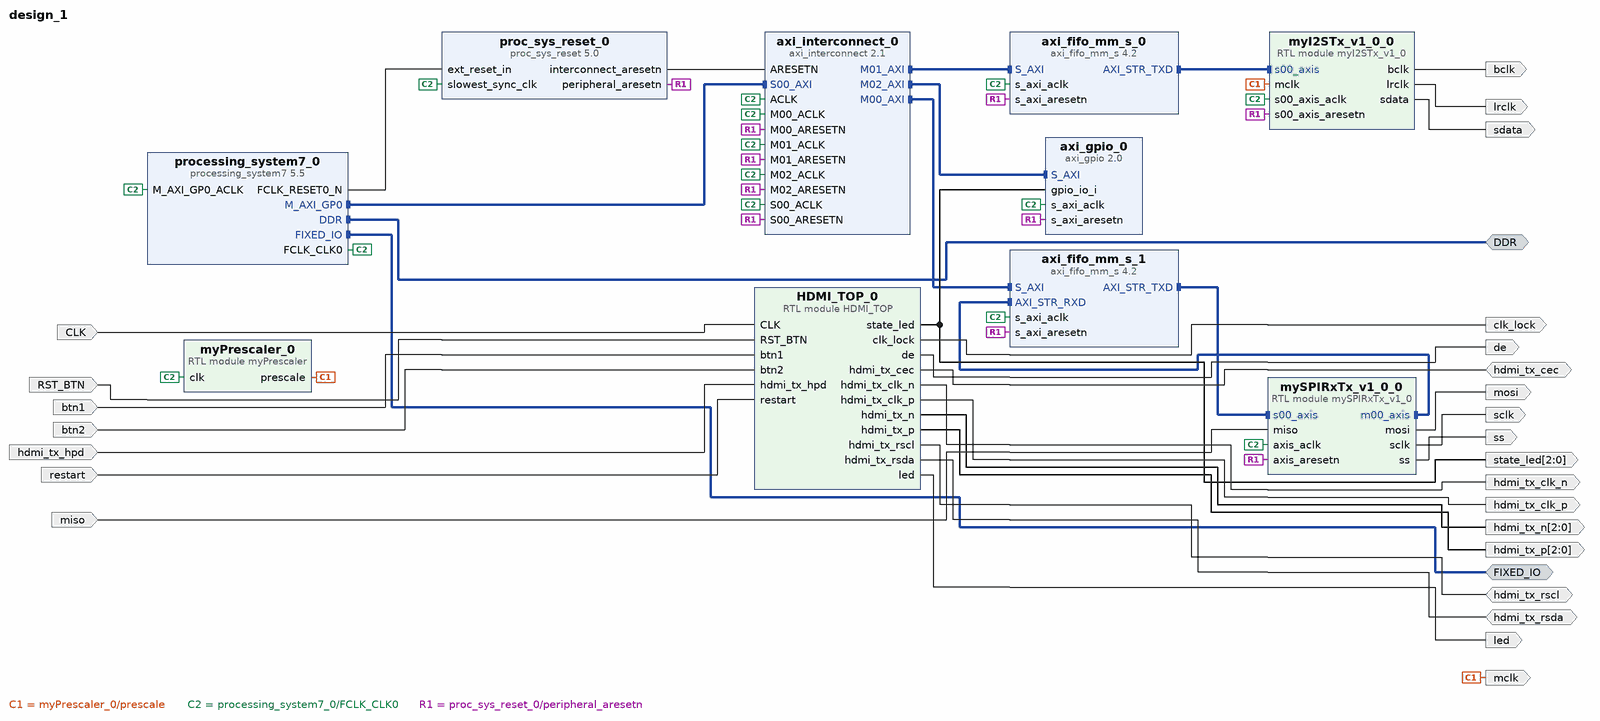
[diagram p0: block diagram of the top level]
# Vivado block design design_1, xc7z020clg400-1, Vivado 2020.2.2
create_bd_design design_1

create_bd_intf_port -mode Master -vlnv xilinx.com:interface:ddrx_rtl:1.0 DDR
create_bd_intf_port -mode Master -vlnv xilinx.com:display_processing_system7:fixedio_rtl:1.0 FIXED_IO
create_bd_port -dir I miso
create_bd_port -dir O mclk
create_bd_port -dir O bclk
create_bd_port -dir O lrclk
create_bd_port -dir O sdata
create_bd_port -dir O sclk
create_bd_port -dir O mosi
create_bd_port -dir O ss
create_bd_port -dir I -type clk CLK
create_bd_port -dir I RST_BTN
create_bd_port -dir I btn1
create_bd_port -dir I btn2
create_bd_port -dir O clk_lock
create_bd_port -dir O de
create_bd_port -dir IO hdmi_tx_cec
create_bd_port -dir O -type clk hdmi_tx_clk_n
create_bd_port -dir O -type clk hdmi_tx_clk_p
create_bd_port -dir I hdmi_tx_hpd
create_bd_port -dir O -from 2 -to 0 hdmi_tx_n
create_bd_port -dir O -from 2 -to 0 hdmi_tx_p
create_bd_port -dir IO hdmi_tx_rscl
create_bd_port -dir IO hdmi_tx_rsda
create_bd_port -dir O led
create_bd_port -dir I restart
create_bd_port -dir O -from 2 -to 0 state_led

create_bd_cell -type ip -vlnv xilinx.com:ip:processing_system7:5.5 processing_system7_0
set_property -dict [list \
  CONFIG.PCW_APU_PERIPHERAL_FREQMHZ 650 \
  CONFIG.PCW_CRYSTAL_PERIPHERAL_FREQMHZ 50 \
  CONFIG.PCW_ENET0_ENET0_IO {MIO 16 .. 27} \
  CONFIG.PCW_ENET0_GRP_MDIO_ENABLE 1 \
  CONFIG.PCW_ENET0_GRP_MDIO_IO {MIO 52 .. 53} \
  CONFIG.PCW_ENET0_PERIPHERAL_ENABLE 1 \
  CONFIG.PCW_ENET0_RESET_ENABLE 1 \
  CONFIG.PCW_ENET0_RESET_IO {MIO 9} \
  CONFIG.PCW_ENET_RESET_ENABLE 1 \
  CONFIG.PCW_ENET_RESET_SELECT {Share reset pin} \
  CONFIG.PCW_FPGA0_PERIPHERAL_FREQMHZ 100 \
  CONFIG.PCW_FPGA1_PERIPHERAL_FREQMHZ 50 \
  CONFIG.PCW_GPIO_MIO_GPIO_ENABLE 1 \
  CONFIG.PCW_GPIO_MIO_GPIO_IO MIO \
  CONFIG.PCW_I2C_RESET_ENABLE 1 \
  CONFIG.PCW_M_AXI_GP0_FREQMHZ 10 \
  CONFIG.PCW_PERIPHERAL_BOARD_PRESET None \
  CONFIG.PCW_PRESET_BANK1_VOLTAGE {LVCMOS 1.8V} \
  CONFIG.PCW_QSPI_GRP_FBCLK_ENABLE 1 \
  CONFIG.PCW_QSPI_GRP_FBCLK_IO {MIO 8} \
  CONFIG.PCW_QSPI_GRP_SINGLE_SS_ENABLE 1 \
  CONFIG.PCW_QSPI_GRP_SINGLE_SS_IO {MIO 1 .. 6} \
  CONFIG.PCW_QSPI_PERIPHERAL_ENABLE 1 \
  CONFIG.PCW_QSPI_QSPI_IO {MIO 1 .. 6} \
  CONFIG.PCW_SD0_GRP_CD_ENABLE 1 \
  CONFIG.PCW_SD0_GRP_CD_IO {MIO 47} \
  CONFIG.PCW_SD0_GRP_WP_ENABLE 0 \
  CONFIG.PCW_SD0_PERIPHERAL_ENABLE 1 \
  CONFIG.PCW_SD0_SD0_IO {MIO 40 .. 45} \
  CONFIG.PCW_SDIO_PERIPHERAL_FREQMHZ 50 \
  CONFIG.PCW_SINGLE_QSPI_DATA_MODE x4 \
  CONFIG.PCW_UART0_PERIPHERAL_ENABLE 1 \
  CONFIG.PCW_UART0_UART0_IO {MIO 14 .. 15} \
  CONFIG.PCW_UART1_PERIPHERAL_ENABLE 0 \
  CONFIG.PCW_UART_PERIPHERAL_FREQMHZ 100 \
  CONFIG.PCW_UIPARAM_DDR_BUS_WIDTH {16 Bit} \
  CONFIG.PCW_UIPARAM_DDR_FREQ_MHZ 525 \
  CONFIG.PCW_UIPARAM_DDR_PARTNO {MT41J256M16 RE-125} \
  CONFIG.PCW_USB0_PERIPHERAL_ENABLE 1 \
  CONFIG.PCW_USB0_RESET_ENABLE 1 \
  CONFIG.PCW_USB0_RESET_IO {MIO 46} \
  CONFIG.PCW_USB0_USB0_IO {MIO 28 .. 39} \
  CONFIG.PCW_USB_RESET_ENABLE 1 \
  CONFIG.PCW_USB_RESET_SELECT {Share reset pin} \
] [get_bd_cells processing_system7_0]
# 481 more settings of processing_system7_0 are not shown: defaults, MIO pin electricals, DDR timing, and values the tool derives
create_bd_cell -type ip -vlnv xilinx.com:ip:proc_sys_reset:5.0 proc_sys_reset_0
create_bd_cell -type ip -vlnv xilinx.com:ip:axi_interconnect:2.1 axi_interconnect_0
set_property -dict {CONFIG.NUM_MI 3} [get_bd_cells axi_interconnect_0]
create_bd_cell -type module -reference myPrescaler myPrescaler_0
set_property -dict {CONFIG.CounterWidth 4 CONFIG.ResetValue 4} [get_bd_cells myPrescaler_0]
create_bd_cell -type ip -vlnv xilinx.com:ip:axi_fifo_mm_s:4.2 axi_fifo_mm_s_0
set_property -dict {CONFIG.C_HAS_AXIS_TSTRB true CONFIG.C_USE_RX_DATA 0 CONFIG.C_USE_TX_CTRL 0} [get_bd_cells axi_fifo_mm_s_0]
create_bd_cell -type ip -vlnv xilinx.com:ip:axi_fifo_mm_s:4.2 axi_fifo_mm_s_1
set_property -dict {CONFIG.C_HAS_AXIS_TSTRB true CONFIG.C_USE_TX_CTRL 0} [get_bd_cells axi_fifo_mm_s_1]
create_bd_cell -type module -reference myI2STx_v1_0 myI2STx_v1_0_0
create_bd_cell -type module -reference mySPIRxTx_v1_0 mySPIRxTx_v1_0_0
create_bd_cell -type ip -vlnv xilinx.com:ip:axi_gpio:2.0 axi_gpio_0
set_property -dict [list \
  CONFIG.C_ALL_INPUTS 1 \
  CONFIG.C_GPIO_WIDTH 3 \
  CONFIG.C_IS_DUAL 0 \
  CONFIG.GPIO_BOARD_INTERFACE Custom \
] [get_bd_cells axi_gpio_0]
create_bd_cell -type module -reference HDMI_TOP HDMI_TOP_0

# ---- connections ----

connect_bd_intf_net [get_bd_intf_pins axi_interconnect_0/M00_AXI] [get_bd_intf_pins axi_fifo_mm_s_1/S_AXI]
connect_bd_intf_net [get_bd_intf_ports DDR] [get_bd_intf_pins processing_system7_0/DDR]
connect_bd_intf_net [get_bd_intf_pins axi_fifo_mm_s_1/AXI_STR_TXD] [get_bd_intf_pins mySPIRxTx_v1_0_0/s00_axis]
connect_bd_intf_net [get_bd_intf_pins myI2STx_v1_0_0/s00_axis] [get_bd_intf_pins axi_fifo_mm_s_0/AXI_STR_TXD]
connect_bd_intf_net [get_bd_intf_pins axi_fifo_mm_s_0/S_AXI] [get_bd_intf_pins axi_interconnect_0/M01_AXI]
connect_bd_intf_net [get_bd_intf_pins mySPIRxTx_v1_0_0/m00_axis] [get_bd_intf_pins axi_fifo_mm_s_1/AXI_STR_RXD]
connect_bd_intf_net [get_bd_intf_pins processing_system7_0/M_AXI_GP0] [get_bd_intf_pins axi_interconnect_0/S00_AXI]
connect_bd_intf_net [get_bd_intf_pins axi_interconnect_0/M02_AXI] [get_bd_intf_pins axi_gpio_0/S_AXI]
connect_bd_intf_net [get_bd_intf_ports FIXED_IO] [get_bd_intf_pins processing_system7_0/FIXED_IO]
connect_bd_net -net miso_0_1 [get_bd_ports miso] [get_bd_pins mySPIRxTx_v1_0_0/miso]
connect_bd_net [get_bd_pins myPrescaler_0/prescale] [get_bd_ports mclk] [get_bd_pins myI2STx_v1_0_0/mclk]
connect_bd_net [get_bd_pins myI2STx_v1_0_0/bclk] [get_bd_ports bclk]
connect_bd_net [get_bd_pins myI2STx_v1_0_0/lrclk] [get_bd_ports lrclk]
connect_bd_net [get_bd_pins myI2STx_v1_0_0/sdata] [get_bd_ports sdata]
connect_bd_net [get_bd_pins mySPIRxTx_v1_0_0/sclk] [get_bd_ports sclk]
connect_bd_net [get_bd_pins mySPIRxTx_v1_0_0/mosi] [get_bd_ports mosi]
connect_bd_net [get_bd_pins mySPIRxTx_v1_0_0/ss] [get_bd_ports ss]
connect_bd_net [get_bd_pins processing_system7_0/FCLK_CLK0] \
  [get_bd_pins processing_system7_0/M_AXI_GP0_ACLK] [get_bd_pins axi_interconnect_0/S00_ACLK] \
  [get_bd_pins proc_sys_reset_0/slowest_sync_clk] [get_bd_pins axi_fifo_mm_s_0/s_axi_aclk] \
  [get_bd_pins axi_interconnect_0/M00_ACLK] [get_bd_pins axi_interconnect_0/ACLK] [get_bd_pins axi_fifo_mm_s_1/s_axi_aclk] \
  [get_bd_pins axi_interconnect_0/M01_ACLK] [get_bd_pins myPrescaler_0/clk] [get_bd_pins axi_interconnect_0/M02_ACLK] \
  [get_bd_pins myI2STx_v1_0_0/s00_axis_aclk] [get_bd_pins mySPIRxTx_v1_0_0/axis_aclk] [get_bd_pins axi_gpio_0/s_axi_aclk]
connect_bd_net [get_bd_pins processing_system7_0/FCLK_RESET0_N] [get_bd_pins proc_sys_reset_0/ext_reset_in]
connect_bd_net [get_bd_pins proc_sys_reset_0/interconnect_aresetn] [get_bd_pins axi_interconnect_0/ARESETN]
connect_bd_net [get_bd_pins proc_sys_reset_0/peripheral_aresetn] \
  [get_bd_pins myI2STx_v1_0_0/s00_axis_aresetn] [get_bd_pins mySPIRxTx_v1_0_0/axis_aresetn] \
  [get_bd_pins axi_interconnect_0/M02_ARESETN] [get_bd_pins axi_interconnect_0/M01_ARESETN] \
  [get_bd_pins axi_interconnect_0/M00_ARESETN] [get_bd_pins axi_interconnect_0/S00_ARESETN] \
  [get_bd_pins axi_fifo_mm_s_0/s_axi_aresetn] [get_bd_pins axi_fifo_mm_s_1/s_axi_aresetn] \
  [get_bd_pins axi_gpio_0/s_axi_aresetn]
connect_bd_net -net CLK_0_1 [get_bd_ports CLK] [get_bd_pins HDMI_TOP_0/CLK]
connect_bd_net -net RST_BTN_0_1 [get_bd_ports RST_BTN] [get_bd_pins HDMI_TOP_0/RST_BTN]
connect_bd_net -net btn1_0_1 [get_bd_ports btn1] [get_bd_pins HDMI_TOP_0/btn1]
connect_bd_net -net btn2_0_1 [get_bd_ports btn2] [get_bd_pins HDMI_TOP_0/btn2]
connect_bd_net [get_bd_pins HDMI_TOP_0/clk_lock] [get_bd_ports clk_lock]
connect_bd_net [get_bd_pins HDMI_TOP_0/de] [get_bd_ports de]
connect_bd_net [get_bd_ports hdmi_tx_cec] [get_bd_pins HDMI_TOP_0/hdmi_tx_cec]
connect_bd_net [get_bd_pins HDMI_TOP_0/hdmi_tx_clk_n] [get_bd_ports hdmi_tx_clk_n]
connect_bd_net [get_bd_pins HDMI_TOP_0/hdmi_tx_clk_p] [get_bd_ports hdmi_tx_clk_p]
connect_bd_net -net hdmi_tx_hpd_0_1 [get_bd_ports hdmi_tx_hpd] [get_bd_pins HDMI_TOP_0/hdmi_tx_hpd]
connect_bd_net [get_bd_pins HDMI_TOP_0/hdmi_tx_n] [get_bd_ports hdmi_tx_n]
connect_bd_net [get_bd_pins HDMI_TOP_0/hdmi_tx_p] [get_bd_ports hdmi_tx_p]
connect_bd_net [get_bd_ports hdmi_tx_rscl] [get_bd_pins HDMI_TOP_0/hdmi_tx_rscl]
connect_bd_net [get_bd_ports hdmi_tx_rsda] [get_bd_pins HDMI_TOP_0/hdmi_tx_rsda]
connect_bd_net [get_bd_pins HDMI_TOP_0/led] [get_bd_ports led]
connect_bd_net -net restart_0_1 [get_bd_ports restart] [get_bd_pins HDMI_TOP_0/restart]
connect_bd_net [get_bd_pins HDMI_TOP_0/state_led] [get_bd_ports state_led] [get_bd_pins axi_gpio_0/gpio_io_i]

# ---- address map ----
assign_bd_address -offset 0x41200000 -range 64K -target_address_space [get_bd_addr_spaces processing_system7_0/Data] [get_bd_addr_segs axi_gpio_0/S_AXI/Reg]
assign_bd_address -offset 0x43C00000 -range 64K -target_address_space [get_bd_addr_spaces processing_system7_0/Data] [get_bd_addr_segs axi_fifo_mm_s_0/S_AXI/Mem0]
assign_bd_address -offset 0x43C10000 -range 64K -target_address_space [get_bd_addr_spaces processing_system7_0/Data] [get_bd_addr_segs axi_fifo_mm_s_1/S_AXI/Mem0]

validate_bd_design
save_bd_design
